# EasyEDA Pro project 主板以及2.4GHz接收器.eprj, board CH585D-DG-R0-1v0
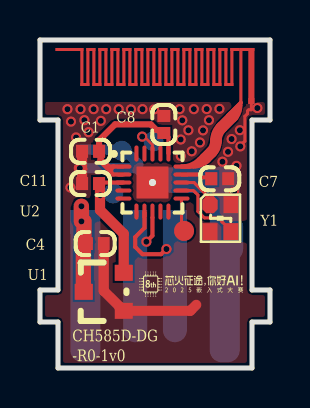
[diagram p8: board, top side]
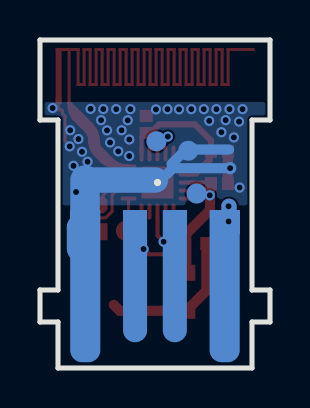
[diagram p9: board, bottom side, seen from below]

Outline 11.5 x 16.4 mm; copper layers: Top Layer, Bottom Layer. Coordinates in mm from the lower left corner of the outline.
Outline path: 0,16.4 0,12.4 0.9,12.4 0.9,3.9 0,3.9 0,2.3 0.9,2.3 0.9,0 10.6,0 10.6,2.3 11.5,2.3 11.5,3.9 10.6,3.9 10.6,12.4 11.5,12.4 11.5,16.4 0,16.4
Stack: Top Layer 0.0356mm / Dielectric 1 0.32mm FR-4 er 4.8 / Bottom Layer 0.0356mm

## Design rules (mm)
net C1: CH585D-DG-R0-1v0
net C4: CH585D-DG-R0-1v0
net C7: CH585D-DG-R0-1v0
net C11: CH585D-DG-R0-1v0
net E1: CH585D-DG-R0-1v0
net P3: CH585D-DG-R0-1v0
net U1: CH585D-DG-R0-1v0
net Y1: CH585D-DG-R0-1v0
net SCSS: CH585D-DG-R0-1v0
net C8: CH585D-DG-R0-1v0
net U2: CH585D-DG-R0-1v0
spacing Clearance_2: track to track 0.152, other pairs 0.152 to 0.152
spacing Clearance (default): track to track 0.152, other pairs 0.152 to 0.203
spacing Clearance_1: track to track 0.152, other pairs 0.203 to 0.203
track width Width (default): min 0.127, default 0.127, max 2.54
differential pair DiffPairsRouting (default): width min 0.152, default 0.152, max 0.381; gap min 0.178, default 0.178
via RoutingVias (default): diameter min 0.508, default 0.711, max 1.27; hole min 0.305, default 0.406, max 0.711
net ANT uses Clearance_2

## Placement (name value [footprint] x y rotation side)
C1  1uF  [0402_C]  2.1 10.84 90 top
C4  100pF  [0402_C]  3.19 6.22 270 top
C7  1uF  [0402_C]  8.56 9.46 90 top
C8  0.1uF  [0402_C]  6.19 11.75 180 top
C11  2.2uF  [0402_C]  2.1 9.22 90 top
E1  ANTENNA  [ANT-F-1-2.4G-0.8mmFR4]  10.04 13.28 180 top
NOREF  -  [Pad_ie21]  7.2 6.86 180 top
NOREF#2  -  [Pad_ie19]  3.67 8.72 0 top
NOREF#3  -  [Pad_ie20]  5.68 11.34 0 top
NOREF#4  -  [Pad_ie18]  4.09 10.86 0 top
P3  USB  [USBAM-4P]  5.75 7.3 180 bottom
U1  6219P33M  [SOT-23]  3.19 3.81 90 top
U2  CH585D  [QFN20_3X3]  5.62 9.27 270 top
Y1  32MHz  [XT2016]  8.5 8.17 270 top

## Footprints (pads in the part's own frame, mm; a bottom-side part is the same pattern mirrored in y, then rotated)
0402_C
  rect 0.65x0.6 smd: 1(0,0) 2(0,-0.85)
ANT-F-1-2.4G-0.8mmFR4
  rect 0.3x0.3 smd: 0(-0.525,-0.075)
  rect 0.15x0.15 smd: 1(0,0)
Pad_ie18
  round 1 smd far side: 1(0,0)
Pad_ie19
  round 1 smd far side: 1(0,0)
Pad_ie20
  round 1 smd far side: 1(0,0)
Pad_ie21
  round 1 smd: 1(0,0)
QFN20_3X3
  round 0.508 hole 0.355: 0(0,0)
  rect 1.6x1.6 smd: 0(0,0)
  oval 0.2x0.8 smd: 1(-0.8,-1.451) 2(-0.4,-1.451) 3(0,-1.451) 4(0.4,-1.451) 5(0.8,-1.451) 11(0.8,1.451) 12(0.4,1.451) 13(0,1.451) 14(-0.4,1.451) 15(-0.8,1.451)
  oval 0.8x0.2 smd: 6(1.451,-0.8) 7(1.451,-0.4) 8(1.451,0) 9(1.451,0.4) 10(1.451,0.8) 16(-1.451,0.8) 17(-1.451,0.4) 18(-1.451,0) 19(-1.451,-0.4) 20(-1.451,-0.8)
SOT-23
  rect 0.8x0.9 smd: 1(-0.95,-1) 2(0.95,-1) 3(0,1)
USBAM-4P
  rect 1.5x1.2 smd: 1(3.5,0) 4(-3.5,0)
  rect 1.2x1.2 smd: 2(1,0) 3(-1,0)
XT2016
  custom 0.85x0.75 smd: 1(0,0)
  rect 0.85x0.75 smd: 2(1.35,0) 3(1.35,1.05) 4(0,1.05)

## Nets
As in the schematic, except:
+3V3: C11.2 NOREF#2.1 U1.2 U2.3
GND: C1.1 C4.1 C7.2 C8.2 C11.1 E1.0 NOREF#4.1 P3.4 U1.1 U2.0 Y1.2 Y1.4
PA14: NOREF#3.1 U2.18
PB22: NOREF.1 U2.11

## Via types
v1: diameter 0.508, hole 0.305, Top Layer to Bottom Layer, 38 vias
v2: diameter 0.61, hole 0.305, Top Layer to Bottom Layer, 3 vias

## Routing (per net, layer and track width the routed paths; a pad name or vN(x,y) marks a point on that pad's centre or on a via; arc(x,y) is an arc through that point)
+3V3: length 6.7
  Top Layer w0.203: 3.1,9.31 3.14,9.27 U2.3
  Top Layer w0.508: C11.2 3,9.18 3,7.9 4.19,6.71 U1.2
  Bottom Layer w0.203: 3.05,8.64 3.09,8.68 3.62,8.68 NOREF#2.1
  vias: v1(3.01,8.64)
+5V: length 5.4
  Top Layer w0.762: 2.2,6.25 2.27,6.32 ; 2.2,6.25 2.2,6.17 ; 2.2,6.25 2.17,6.22 2.17,4.06 ; 2.2,6.25 2.2,7.33 ; v2(2.07,7.33) v2(2.07,8.09)
  Bottom Layer w0.762: 2.05,7.51 2.05,8.09 ; P3.1 2.14,7.3 1.92,7.51 1.92,7.48 v2(2.07,7.33)
GND: length 25.4
  Top Layer w0.152: v1(10.02,11.08) 10.02,11.12 10.24,11.35 10.24,12.59 10.38,12.72 10.38,12.85 10.43,12.91 10.57,12.91 10.57,13.35
  Top Layer w0.508: C4.1 3.19,3.86 3.99,3.06 3.99,3.01 4.14,2.86 7.51,2.86 7.81,3.16 ; 2.1,9.95 C1.1 ; 2.1,9.95 C11.1 2.1,9.2 2.11,9.19 ; 2.1,9.95 2.06,9.99 v2(1.99,9.99)
  Bottom Layer w0.508: 5.15,9.69 4.85,9.99 v2(1.99,9.99) ; 2.04,10.92 4.2,10.92 4.93,10.2
  Bottom Layer w1.27: 5.73,9.4 9.25,9.4
  Bottom Layer w1.473: 9.25,9.4 9.25,7.17 9.42,7 9.42,5.98
  vias: v1(1.37,12.94) v1(1.55,12.32) v1(1.52,9.02) v1(1.81,11.53) v1(2.03,12.94) v1(2.22,12.39) v1(2.43,11.79) v1(2.68,12.94) v1(3.04,12.36) v1(3.31,12.94) v1(3.93,12.94) v1(4.55,12.93) v1(5.12,12.94) v1(5.7,12.93) v1(6.98,12.94) v1(7.03,11.42) v1(7.04,10.6) v1(7.11,12.38) v1(7.42,11.89) v1(7.59,10.83) v1(7.69,12.94) v1(8,11.28) v1(8.15,11.88) v1(8.33,12.95) v1(8.45,12.39) v1(8.97,12.96) v1(9.12,10.31) v1(9.4,10.81) v1(9.58,11.45) v1(9.7,8.8) v1(9.82,10.11) v1(9.99,11.89) v1(10.87,13)
VINTA: length 1.8
  Top Layer w0.203: 7.07,9.67 7.95,9.67 8.09,9.53 8.53,9.53 8.7,9.37
ANT: length 10.9
  Top Layer w0.152: 9.65,12.61 9.85,12.8 arc(9.99,13.02) E1.1 ; E1.1 10.04,13.12 arc(9.97,12.73) 9.74,12.39 ; E1.1 9.41,12.64 9.4,12.64 ; E1.1 arc(10.03,13.19) 9.98,13.12 9.57,12.71 9.57,12.7 ; 9.38,12.64 10.02,13.27
  Top Layer w0.203: 7.45,10.07 7.68,10.07 arc(8.09,10.15) 8.44,10.39 ; 7.45,10.07 7.27,10.07 ; 7.45,10.07 arc(7.53,10.08) 7.61,10.11 ; 8.13,10.62 7.94,10.43 arc(7.55,10.17) 7.07,10.07 7.27,10.07 ; 7.27,10.07 arc(7.44,10.08) 7.61,10.11 ; 7.61,10.11 arc(7.96,10.26) 8.27,10.49
  Top Layer w0.582: 9.65,12.61 9.08,12.04 arc(8.87,11.72) 8.8,11.34 arc(8.74,11.04) 8.56,10.78 8.27,10.49
PA14: length 1.7
  Top Layer w0.127: v1(5.11,11.57) 5.21,11.57 5.62,11.16 U2.18
  Bottom Layer w0.127: 5.58,11.39 5.4,11.39 5.28,11.5 5.18,11.5 v1(5.11,11.57)
PB12: length 1.3
  Top Layer w0.203: v1(5.32,6.31) 5.62,6.62 5.62,7.52
PB13: length 3.8
  Top Layer w0.203: v1(6.32,5.95) 6.31,5.95 6.05,5.69 5.12,5.69 4.76,6.05 4.76,6.55 5.22,7.01 5.22,7.82
PB22: length 1.7
  Top Layer w0.152: 7.07,6.74 7.07,8.47
VDCIA: length 9.3
  Top Layer w0.203: 3.45,10.07 3.08,10.45 3.08,10.8 ; 3.45,10.07 3.67,10.07 ; 3.45,10.07 3.56,9.97 3.56,9.81 ; 2.97,10.68 2.97,10.37 3.66,9.67 U2.2 ; 3.67,10.07 U2.1 ; 3.67,10.07 3.71,10.07 ; 3.67,10.07 3.58,9.99 ; U2.16 6.42,11.54 6.23,11.74
  Top Layer w0.305: 2.95,10.82 2.95,11.38 3.75,12.18 5.54,12.18 5.82,11.9 6.04,11.9 C8.1
X32MI: length 1.9
  Top Layer w0.152: 7.07,9.27 7.7,9.27 8.34,8.63 8.34,8.51 8.54,8.31
X32MO: length 3.7
  Top Layer w0.152: 9.47,6.96 9.45,6.96 9.1,7.31 9.1,7.33 8.93,7.5 8.22,7.5 7.89,7.83 7.89,8.65 7.75,8.79 7.67,8.87 7.07,8.87

## Copper pours and planes (outline as drawn; the poured copper is in the pictures)
GND on Top Layer: 0,13.45 11.5,13.45 11.5,0 0,0
GND on Bottom Layer: 0,13.42 0,8.23 11.5,8.23 11.5,13.42

Small or netless copper shapes (teardrops, artwork), in the pictures only: 1 on Top Layer

## Text on the board
Top Silkscreen Layer: CH585D-DG | -R0-1v0
